# EAGLE design turing_base (EAGLE 5.10)
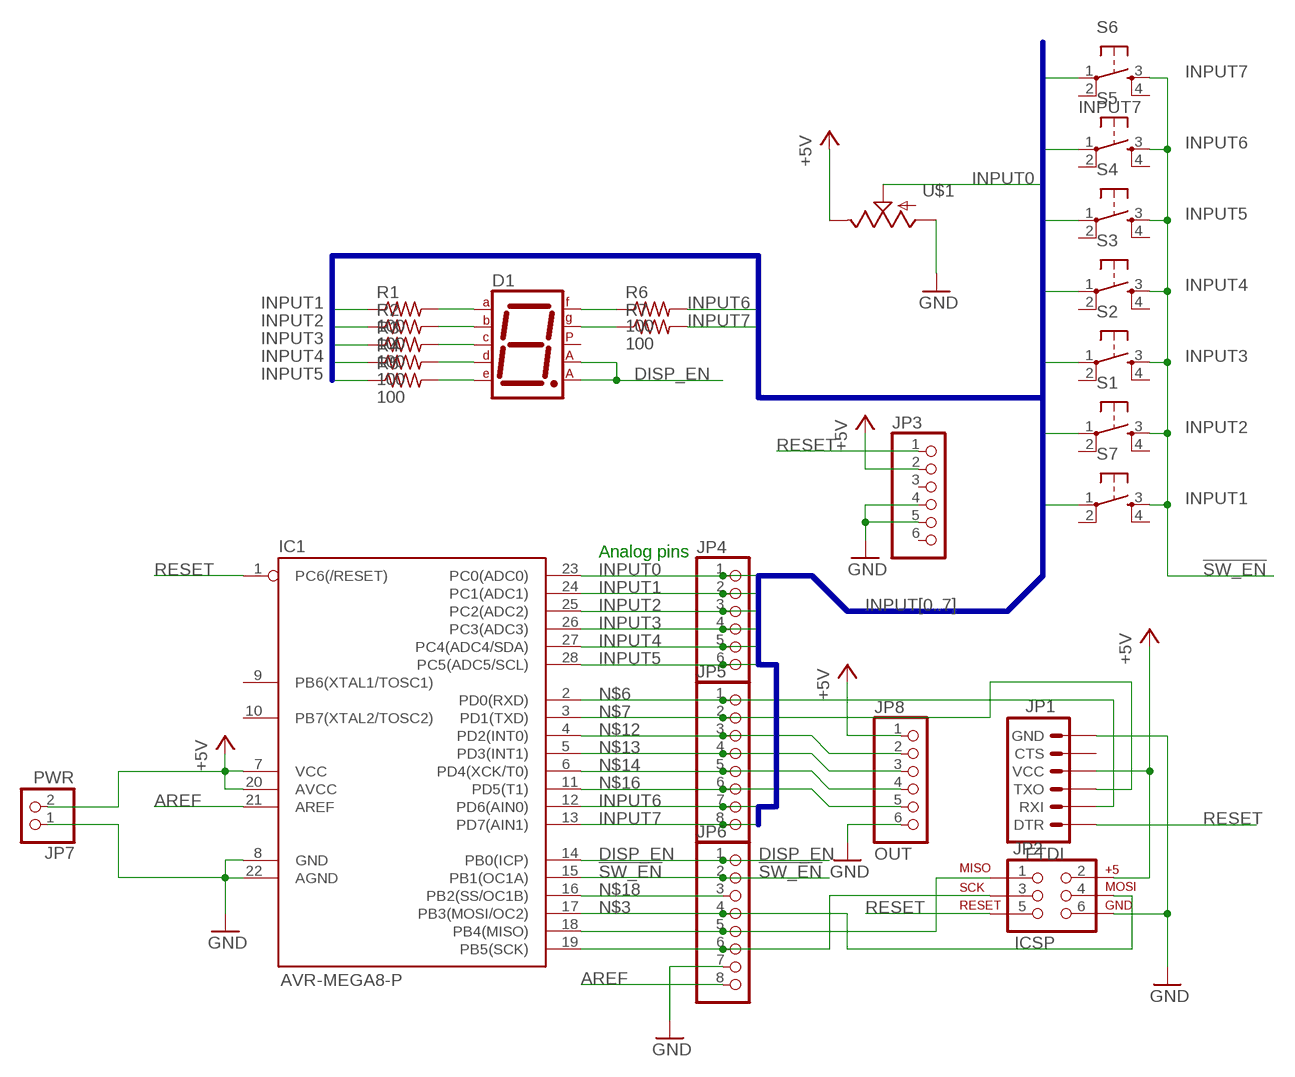
[diagram p0: schematic, sheet 1]

## Parts
D1  7SEG-CA  [7SEG-13]
IC1  AVR-MEGA8-P  [DIL28-3]
JP1  FTDI  ARDUINO_SERIAL_PROGRAMPTH  [1X06]
JP2  ICSP  AVR_SPI_PRG_6PTH  [2X3]
JP3  PINHD-1X6  [1X06]
JP4  PINHD-1X6  [1X06]
JP5  PINHD-1X8  [1X08]
JP6  PINHD-1X8  [1X08]
JP7  PWR  PINHD-1X2  [1X02]
JP8  OUT  PINHD-1X6  [1X06]
R1  100  R-US_0207/10  [0207/10]
R2  100  R-US_0207/10  [0207/10]
R3  100  R-US_0207/10  [0207/10]
R4  100  R-US_0207/10  [0207/10]
R5  100  R-US_0207/10  [0207/10]
R6  100  R-US_0207/10  [0207/10]
R7  100  R-US_0207/10  [0207/10]
S1  TAC_SWITCHPTH  [TACTILE-PTH]
S2  TAC_SWITCHPTH  [TACTILE-PTH]
S3  TAC_SWITCHPTH  [TACTILE-PTH]
S4  TAC_SWITCHPTH  [TACTILE-PTH]
S5  TAC_SWITCHPTH  [TACTILE-PTH]
S6  TAC_SWITCHPTH  [TACTILE-PTH]
S7  TAC_SWITCHPTH  [TACTILE-PTH]
U$1  POT  [ALPS_POT]

## Nets
!SW_EN: IC1.15(PB1(OC1A)) JP6.2 S1.3 S2.3 S3.3 S4.3 S5.3 S6.3 S7.3
+5V: IC1.7(VCC) IC1.20(AVCC) JP1.4(VCC) JP2.2 JP3.2 JP7.2 JP8.1 U$1.P$1(E)
AREF: IC1.21(AREF) JP6.8
DISP_EN: D1.3(CA1) D1.8(CA2) IC1.14(PB0(ICP)) JP6.1
GND: IC1.8(GND) IC1.22(AGND) JP1.6(GND) JP2.6 JP3.4 JP3.5 JP6.7 JP7.1 JP8.6 U$1.P$3(A)
INPUT0: IC1.23(PC0(ADC0)) JP4.1 U$1.P$2(S)
INPUT1: IC1.24(PC1(ADC1)) JP4.2 R1.1 S7.1
INPUT2: IC1.25(PC2(ADC2)) JP4.3 R2.1 S1.1
INPUT3: IC1.26(PC3(ADC3)) JP4.4 R3.1 S2.1
INPUT4: IC1.27(PC4(ADC4/SDA)) JP4.5 R4.1 S3.1
INPUT5: IC1.28(PC5(ADC5/SCL)) JP4.6 R5.1 S4.1
INPUT6: IC1.12(PD6(AIN0)) JP5.7 R6.2 S5.1
INPUT7: IC1.13(PD7(AIN1)) JP5.8 R7.2 S6.1
N$1: D1.7(A) R1.2
N$2: D1.6(B) R2.2
N$3: IC1.17(PB3(MOSI/OC2)) JP2.4 JP6.4
N$4: IC1.18(PB4(MISO)) JP2.1 JP6.5
N$5: IC1.19(PB5(SCK)) JP2.3 JP6.6
N$6: IC1.2(PD0(RXD)) JP1.2(RXI) JP5.1
N$7: IC1.3(PD1(TXD)) JP1.3(TXO) JP5.2
N$8: D1.4(C) R3.2
N$9: D1.2(D) R4.2
N$10: D1.1(E) R5.2
N$11: D1.9(F) R6.1
N$12: IC1.4(PD2(INT0)) JP5.3 JP8.2
N$13: IC1.5(PD3(INT1)) JP5.4 JP8.3
N$14: IC1.6(PD4(XCK/T0)) JP5.5 JP8.4
N$15: D1.10(G) R7.1
N$16: IC1.11(PD5(T1)) JP5.6 JP8.5
N$18: IC1.16(PB2(SS/OC1B)) JP6.3
RESET: IC1.1(PC6(/RESET)) JP1.1(DTR) JP2.5 JP3.1
Unconnected: D1.5(DP) IC1.9(PB6(XTAL1/TOSC1)) IC1.10(PB7(XTAL2/TOSC2)) JP1.5(CTS) JP3.3 JP3.6 S1.2 S1.4 S2.2 S2.4 S3.2 S3.4 S4.2 S4.4 S5.2 S5.4 S6.2 S6.4 S7.2 S7.4

## Buses
INPUT[0..7]

## Notes on the sheet
- Analog pins

## Library data of the parts
D1 = special:7SEG-CA: 7-segment DISPLAY single anode, 13 mm
IC1 = SparkFun:AVR-MEGA8-P: MICROCONTROLLER 8 Kbytes FLASH 1 kbytes SRAM 512 bytes EEPROM USART 4-channel 10 bit ADC 2-channel 8 bit ADC
JP1 = SparkFun:ARDUINO_SERIAL_PROGRAM
JP2 = SparkFun:AVR_SPI_PRG_6: AVR ISP 6 Pin This is the reduced ISP connector for AVR programming. Common on Arduino. This footprint will take up less PCB space and can be used with a 10-pin to 6-pin adapter such as SKU: BOB-08508
JP3 JP4 JP8 = pinhead:PINHD-1X6: PIN HEADER
JP5 JP6 = pinhead:PINHD-1X8: PIN HEADER
JP7 = pinhead:PINHD-1X2: PIN HEADER
R1-R7 = resistor:R-US_: RESISTOR, American symbol
S1-S7 = SparkFun:TAC_SWITCH: Momentary Switch Button commonly used for reset or general input. Spark Fun Electronics SKU : COM-00097
U$1 = SparkFun:POT

## Board
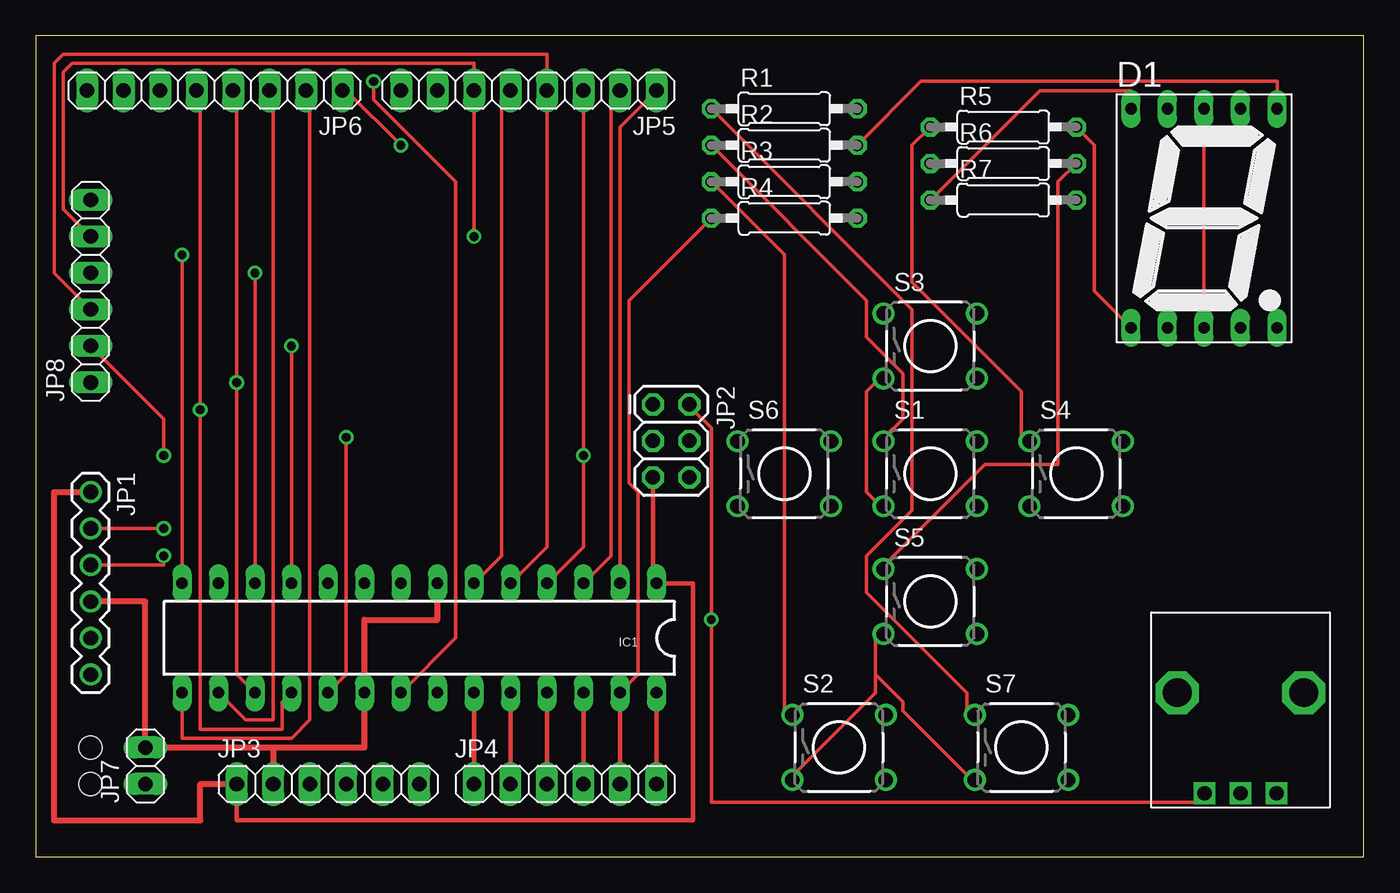
[diagram p1: board, top side]
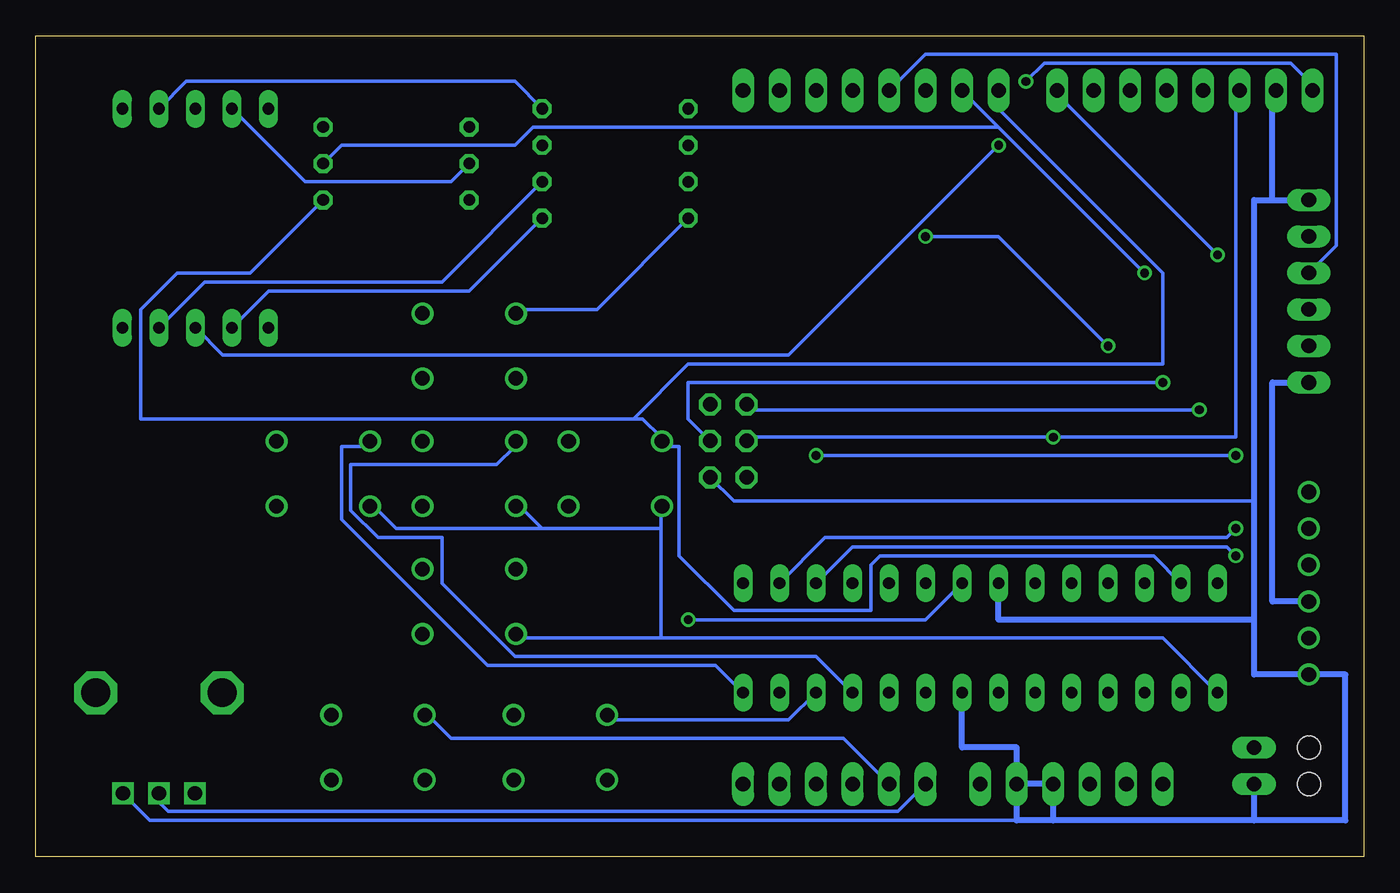
[diagram p2: board, bottom side, seen from below]

Size 92.38 x 57.14 mm. Coordinates in mm from the lower left corner, seen from the top.
Outline: 0,0 92.38,0 92.38,57.14 0,57.14 0,0
Copper layers (1*16): Top 0.035mm / dielectric 1.5mm / Bottom 0.035mm
Design rules "default *": minimum track width 10mil, minimum drill 24mil, track to track 10mil, track to pad 10mil, pad to pad 10mil, via to via 10mil, smd to smd 8mil, copper to edge 40mil, drill to drill 8mil, minimum pad ring 10mil, minimum via ring 8mil, stop-mask expansion 4mil, vias tented up to drill 0mil, thermal gap 10mil
Holes 1.6 mm at 3.81,7.62 3.81,5.08

### Footprints (pad centres in the part's own frame; a part is rotated, then mirrored left to right if it is on the bottom)
7SEG-13 = drill 0.813 long: 1 -5.08,-7.62; 2 -2.54,-7.62; 3 0,-7.62; 4 2.54,-7.62; 5 5.08,-7.62; 6 5.08,7.62; 7 2.54,7.62; 8 0,7.62; 9 -2.54,7.62; 10 -5.08,7.62
DIL28-3 = drill 0.813 long: 1 -13.97,-3.81; 2 -11.43,-3.81; 3 -8.89,-3.81; 4 -6.35,-3.81; 5 -3.81,-3.81; 6 -1.27,-3.81; 7 1.27,-3.81; 8 3.81,-3.81; 9 6.35,-3.81; 10 8.89,-3.81; 11 11.43,-3.81; 12 13.97,-3.81; 13 16.51,-3.81; 14 19.05,-3.81; 15 19.05,3.81; 16 16.51,3.81; 17 13.97,3.81; 18 11.43,3.81; 19 8.89,3.81; 20 6.35,3.81; 21 3.81,3.81; 22 1.27,3.81; 23 -1.27,3.81; 24 -3.81,3.81; 25 -6.35,3.81; 26 -8.89,3.81; 27 -11.43,3.81; 28 -13.97,3.81
1X06 = drill 1.016 round: 1 0,0; 2 2.54,0; 3 5.08,0; 4 7.62,0; 5 10.16,0; 6 12.7,0
2X3 = drill 1.016 octagon: 1 0,0; 2 0,2.54; 3 2.54,0; 4 2.54,2.54; 5 5.08,0; 6 5.08,2.54
1X06' = drill 1.016 long: 1 -6.35,0; 2 -3.81,0; 3 -1.27,0; 4 1.27,0; 5 3.81,0; 6 6.35,0
1X08 = drill 1.016 long: 1 -8.89,0; 2 -6.35,0; 3 -3.81,0; 4 -1.27,0; 5 1.27,0; 6 3.81,0; 7 6.35,0; 8 8.89,0
1X02 = drill 1.016 long: 1 -1.27,0; 2 1.27,0
0207/10 = drill 0.813 octagon: 1 -5.08,0; 2 5.08,0
TACTILE-PTH = drill 1.016 round: 1 -3.251,2.261; 2 3.251,2.261; 3 -3.251,-2.261; 4 3.251,-2.261
ALPS_POT = drill 1 square: P$1 7,-2.5; P$2 7,0; P$3 7,2.5 | drill 2 octagon: P$4 0,-4.4; P$5 0,4.4

### Placement (x,y rotation side)
D1  81.28,44.45 0 top
IC1  29.21,15.24 180 top
JP1  3.81,25.4 270 top
JP2  42.93,31.5 270 top
JP3  [1X06']  20.32,5.08 0 top
JP4  [1X06']  36.83,5.08 0 top
JP5  34.29,53.34 180 top
JP6  12.45,53.34 180 top
JP7  7.62,6.35 90 top
JP8  OUT  [1X06']  3.81,39.37 90 top
R1  52.07,52.07 0 top
R2  52.07,49.53 0 top
R3  52.07,46.99 0 top
R4  52.07,44.45 0 top
R5  67.31,50.8 0 top
R6  67.31,48.26 0 top
R7  67.31,45.72 0 top
S1  62.23,26.67 0 top
S2  55.88,7.62 0 top
S3  62.23,35.56 0 top
S4  72.39,26.67 0 top
S5  62.23,17.78 0 top
S6  52.07,26.67 0 top
S7  68.58,7.62 0 top
U$1  83.82,11.43 270 top

### Tracks (layer width: path | path; a pad name or v marks a point on that pad's centre or on a via)
!SW_EN
  Top 0.254: IC1.15 10.16,8.26 17.78,8.26 19.05,9.53 19.05,53.34 JP6.2 | 58.42,12.7 58.42,15.24 S5.3 | 58.42,12.7 58.42,11.43 52.7,5.71 S2.3 | 58.42,12.7 60.33,10.79 60.33,10.16 64.77,5.71 S7.3 | S3.3 58.42,33.02 57.78,32.38 57.78,25.4 58.42,24.77 S1.3
  Bottom 0.254: IC1.15 13.97,15.24 48.9,15.24 | 48.9,15.24 58.42,15.24 S5.3 | 48.9,15.24 48.9,22.86 | 48.9,22.86 48.9,24.13 S6.3 | 57.15,22.86 58.42,24.13 S1.3 | 48.9,22.86 57.15,22.86 | 57.15,22.86 67.31,22.86 68.58,24.13 S4.3
+5V  (via drill 0.61)
  Top 0.254: U$1.P$1 81.28,3.81 46.99,3.81 v46.99,16.51 46.99,29.84 45.72,31.11 JP2.2
  Top 0.406: 16.51,7.62 JP7.2 7.62,17.78 JP1.4 | 16.51,7.62 JP3.2 | 16.51,7.62 22.86,7.62 IC1.20 22.86,16.51 27.94,16.51 IC1.7
  Bottom 0.254: IC1.7 30.48,16.51 v46.99,16.51
  Bottom 0.406: JP1.4 6.35,17.78 6.35,33.02 JP8.1
AREF  (via drill 0.61)
  Top 0.254: IC1.21 29.21,15.24 29.21,46.99 23.5,52.7 v23.5,53.98
  Bottom 0.254: v23.5,53.98 22.23,55.24 5.08,55.24 3.17,53.34 JP6.8
DISP_EN  (via drill 0.61)
  Top 0.254: D1.3 D1.8 | IC1.14 v10.16,41.91 | v25.4,49.53 21.59,53.34 JP6.1
  Bottom 0.254: v10.16,41.91 21.59,53.34 JP6.1 | D1.3 79.38,34.92 40.01,34.92 v25.4,49.53
GND
  Bottom 0.254: 24.13,2.54 84.45,2.54 85.72,3.81 U$1.P$3 | 7.62,24.77 43.81,24.77 JP2.6
  Bottom 0.406: 7.62,2.54 1.27,2.54 1.27,12.7 JP1.6 7.62,12.7 7.62,16.51 | 7.62,2.54 JP7.1 | 7.62,2.54 21.59,2.54 | JP3.5 JP3.4 21.59,2.54 | 21.59,2.54 24.13,2.54 JP3.5 | JP3.5 24.13,7.62 27.94,7.62 IC1.22 | 7.62,16.51 25.4,16.51 IC1.8 | 7.62,16.51 7.62,24.77 7.62,45.72 6.35,45.72 | 6.35,45.72 JP8.6 | JP6.7 6.35,53.34 6.35,45.72
INPUT0
  Top 0.305: JP4.1 IC1.23
  Bottom 0.254: JP4.1 32.38,3.17 83.19,3.17 83.82,3.81 U$1.P$2
INPUT1
  Top 0.254: R1.1 60.96,38.1 60.96,24.13 57.78,20.95 57.78,18.41 64.77,11.43 64.77,10.16 S7.1
  Top 0.305: JP4.2 IC1.24
  Bottom 0.254: JP4.2 36.2,8.26 63.5,8.26 64.77,9.53 S7.1
INPUT2
  Top 0.254: R2.1 57.78,38.73 57.78,36.2 60.33,33.66 60.33,30.48 59.05,29.21 S1.1
  Top 0.305: JP4.3 IC1.25
  Bottom 0.254: IC1.25 38.1,13.97 59.05,13.97 64.14,19.05 64.14,22.23 68.58,22.23 70.48,24.13 70.48,27.3 60.33,27.3 59.05,28.57 S1.1
INPUT3
  Top 0.254: R3.1 52.07,41.91 52.07,10.16 S2.1
  Top 0.305: JP4.4 IC1.26
  Bottom 0.254: IC1.26 40.01,9.53 52.07,9.53 S2.1
INPUT4
  Top 0.254: IC1.27 41.91,12.7 41.91,25.4 41.27,26.04 41.27,38.73 R4.1
  Top 0.305: JP4.5 IC1.27
  Bottom 0.254: R4.1 53.34,38.1 58.42,38.1 S3.1
INPUT5
  Top 0.254: R5.1 60.96,49.53 60.96,40.01 68.58,32.38 68.58,29.21 S4.1
  Top 0.305: JP4.6 IC1.28
  Bottom 0.254: IC1.28 45.09,13.34 60.96,13.34 71.12,23.5 71.12,28.57 69.22,28.57 S4.1
INPUT6  (via drill 0.61)
  Top 0.254: IC1.12 v15.24,40.64 | R6.2 71.12,46.99 71.12,27.3 66.04,27.3 59.05,20.32 S5.1
  Bottom 0.254: 25.4,50.8 JP5.7 | v15.24,40.64 25.4,50.8 | R6.2 71.12,49.53 59.05,49.53 57.78,50.8 25.4,50.8
INPUT7
  Bottom 0.254: IC1.13 14.61,20.95 33.66,20.95 34.29,20.32 34.29,17.14 43.81,17.14 47.62,20.95 47.62,28.57 48.26,28.57 S6.1 48.9,29.21 50.16,30.48 50.8,30.48 | R7.2 77.47,40.64 82.55,40.64 85.09,38.1 85.09,30.48 50.8,30.48 | JP5.8 25.4,52.07 13.97,40.64 13.97,34.29 46.99,34.29 50.8,30.48
N$1
  Bottom 0.254: R1.2 59.05,53.98 81.92,53.98 D1.7
N$2
  Top 0.254: R2.2 61.59,53.98 86.36,53.98 D1.6
N$3  (via drill 0.61)
  Top 0.254: IC1.17 13.97,12.7 v13.97,33.02 13.97,53.34 JP6.4
  Bottom 0.254: v13.97,33.02 46.99,33.02 46.99,30.48 JP2.4
N$4  (via drill 0.61)
  Top 0.254: IC1.18 17.14,10.79 17.14,8.89 11.43,8.89 v11.43,31.11 11.43,53.34 JP6.5
  Bottom 0.254: v11.43,31.11 42.55,31.11 JP2.1
N$5  (via drill 0.61)
  Top 0.254: IC1.19 21.59,12.7 v21.59,29.21
  Bottom 0.254: JP2.3 42.55,29.21 v21.59,29.21 8.89,29.21 8.89,53.34 JP6.6
N$6  (via drill 0.61)
  Top 0.254: IC1.2 40.64,50.8 JP5.1 | JP1.2 v8.89,22.86
  Bottom 0.254: v8.89,22.86 9.53,22.23 37.47,22.23 IC1.2
N$7  (via drill 0.61)
  Top 0.254: IC1.3 40.01,20.95 40.01,52.7 JP5.2 | JP1.3 8.89,20.32 v8.89,20.95
  Bottom 0.254: v8.89,20.95 9.53,21.59 35.56,21.59 IC1.3
N$8
  Bottom 0.254: R3.2 64.14,40.01 80.64,40.01 D1.4
N$9
  Bottom 0.254: R4.2 62.23,39.37 76.2,39.37 D1.2
N$10
  Top 0.254: D1.1 73.66,39.37 73.66,49.53 R5.2
N$11
  Bottom 0.254: R6.1 63.5,46.99 73.66,46.99 D1.9
N$12  (via drill 0.61)
  Top 0.254: IC1.4 38.1,21.59 v38.1,27.94 JP5.3 | JP8.2 8.89,30.48 v8.89,27.94
  Bottom 0.254: v8.89,27.94 v38.1,27.94
N$13
  Top 0.254: IC1.5 35.56,21.59 JP5.4 35.56,55.88 1.91,55.88 1.27,55.24 1.27,40.64 JP8.3
N$14
  Top 0.254: IC1.6 32.38,20.95 32.38,52.7 JP5.5
  Bottom 0.254: JP8.4 1.91,42.55 1.91,55.88 30.48,55.88 JP5.5
N$15
  Top 0.254: R7.1 69.85,53.34 76.2,53.34 D1.10
N$16  (via drill 0.61)
  Top 0.254: IC1.11 v17.78,35.56 | v30.48,43.18 JP5.6 30.48,55.24 2.54,55.24 1.91,54.61 1.91,45.09 JP8.5
  Bottom 0.254: v17.78,35.56 25.4,43.18 v30.48,43.18
N$18
  Top 0.254: IC1.16 14.61,9.53 16.51,9.53 16.51,53.34 JP6.3
RESET
  Top 0.305: JP2.5 42.93,19.05 IC1.1 45.72,19.05 45.72,2.54 13.97,2.54 JP3.1
  Top 0.406: JP3.1 11.43,5.08 11.43,2.54 1.27,2.54 1.27,25.4 JP1.1